# Altium schematic sheet MOSFET_drivers.SchDoc
size 420 x 297 mm; DocumentNumber: ЛАЭ3.20.10.02.05.200 Э3; SheetNumber: 6
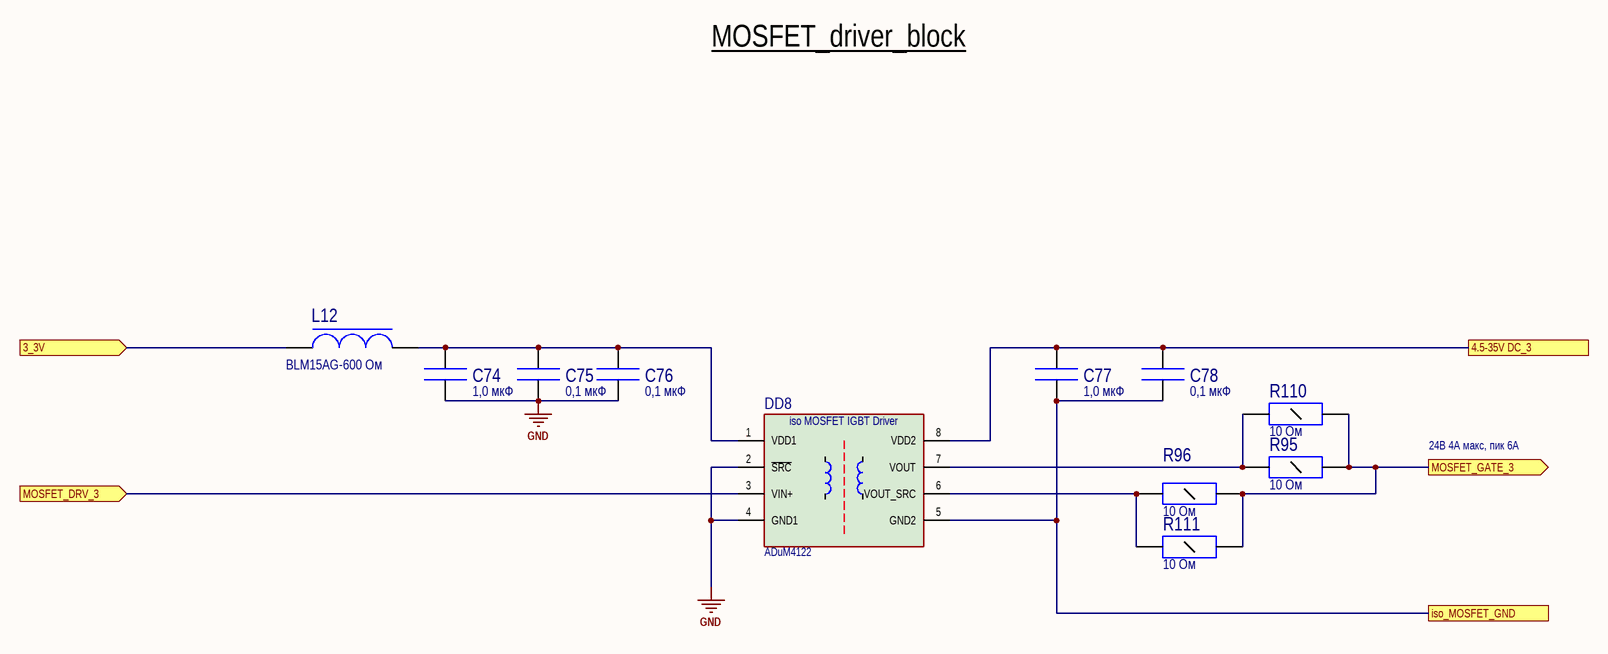
[diagram p0: MOSFET_drivers.SchDoc]

## Parts
C74  value 1,0 мкФ  [CC1206]  (hidden comment: CC1206-X7R-1,0 мкФ-20%-50В)
C75  value 0,1 мкФ  [CC0603]  (hidden comment: CC0603-X7R-0,1 мкФ-20%-50В)
C76  value 0,1 мкФ  [CC0603]  (hidden comment: CC0603-X7R-0,1 мкФ-20%-50В)
C77  value 1,0 мкФ  [CC1206]  (hidden comment: CC1206-X7R-1,0 мкФ-20%-50В)
C78  value 0,1 мкФ  [CC0603]  (hidden comment: CC0603-X7R-0,1 мкФ-20%-50В)
DD8  ADuM4122  [SOIC127P1031X265-8N]
L12  BLM15AG-600 Ом  [CL0402(1005)]
R95  value 10 Ом  [CR1206]  (hidden comment: CR1206-10 Ом-±5%)
R96  value 10 Ом  [CR1206]  (hidden comment: CR1206-10 Ом-±5%)
R110  value 10 Ом  [CR1206]  (hidden comment: CR1206-10 Ом-±5%)
R111  value 10 Ом  [CR1206]  (hidden comment: CR1206-10 Ом-±5%)

## Ports
3_3V (in), 4.5-35V DC_3, iso_MOSFET_GND, MOSFET_DRV_3 (in), MOSFET_GATE_3 (out)

## Nets
GND: C74.2(-) C75.1(+) C76.1(+) DD8.2(~{SRC}) DD8.4(GND1)
3_3V: L12.1 ; port 3_3V
4.5-35V DC_3: C77.1(+) C78.2(-) DD8.8(VDD2) ; port 4.5-35V DC_3
iso_MOSFET_GND: C77.2(-) C78.1(+) DD8.5(GND2) ; port iso_MOSFET_GND
MOSFET_DRV_3: DD8.3(VIN+) ; port MOSFET_DRV_3
MOSFET_GATE_3: R95.2(-) R96.2(-) R110.2(-) R111.2(-) ; port MOSFET_GATE_3
NetC74_1: C74.1(+) C75.2(-) C76.2(-) DD8.1(VDD1) L12.2
NetDD8_6: DD8.6(VOUT_SRC) R96.1(+) R111.1(+)
NetDD8_7: DD8.7(VOUT) R95.1(+) R110.1(+)

## Notes on the sheet
- MOSFET_driver_block
- 24В 4А макс, пик 6А
- Подп. и дата
- Инв. № дубл.
- Взам. инв. №
- Инв. № подл.
- Изм.
- Лист
- № докум.
- Подп.
- Дата
- 2.106-A3
- Копировал
- Формат А3
- (in symbol ADuM4122ARIZ) iso MOSFET IGBT Driver

## Library data of the parts
C74 C77 = CC1206-X7R-#-20%-50В: Чип конденсатор керамический
C75 C76 C78 = CC0603-X7R-#-20%-50В: Чип конденсатор керамический; Компэл: CC0603KRX7R9BB104; Supplier 1: Newark; Supplier Part Number 1: 65R8251
DD8 = ADuM4122ARIZ: Single Gate, Adjustable Slew Rate, Isolated Gate Driver, 3 A Short-Circuit (<3Ω); ComponentLink1Description: Datasheet; ComponentLink1URL: https://www.analog.com/media/en/technical-documentation/data-sheets/ADuM4122.pdf
L12 = BLM15: Чип индуктивность подавления EMP; VALUE: 600 Ом; Компэл: BLM15AG601SN1D; Supplier 1: Farnell; Supplier Part Number 1: 1515762
R95 R96 R110 R111 = CR1206-#-±5%: Чип резистор; Supplier 1: Mouser; Supplier Part Number 1: 652-CR1206JW-361ELF